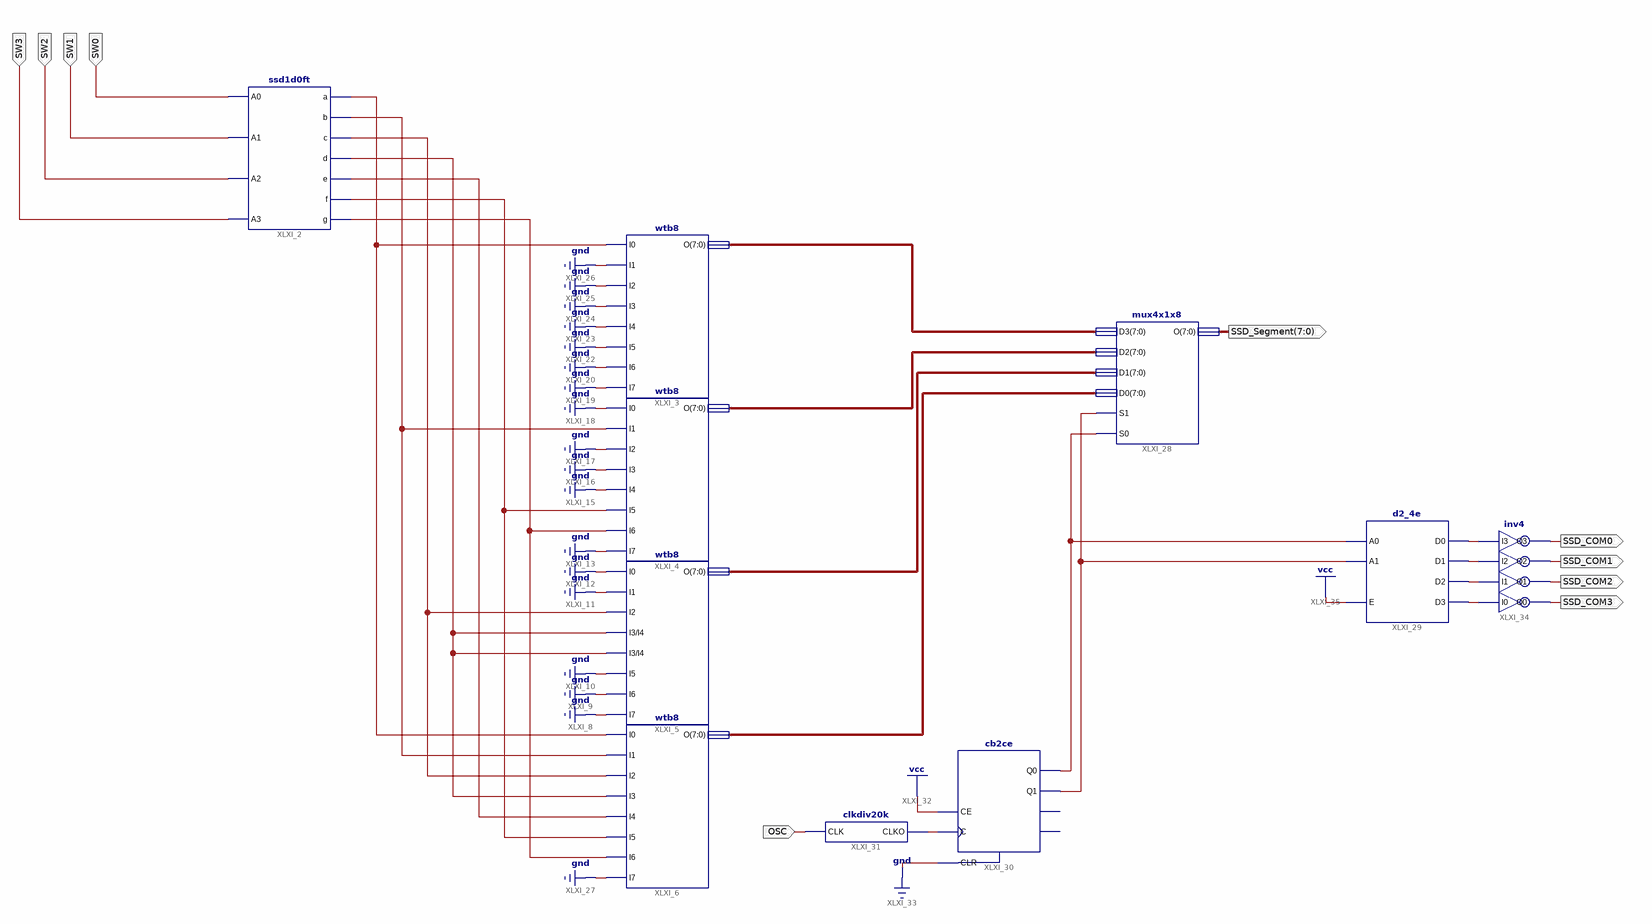
[diagram p0: schematic sheet 1]
// Xilinx ISE schematic main.sch (spartan6) as structural Verilog: 10 symbols, 10 ports
module main (
  input  SW3,
  input  SW2,
  input  SW1,
  input  SW0,
  input  OSC,
  output [7:0] SSD_Segment,
  output SSD_COM3,
  output SSD_COM2,
  output SSD_COM1,
  output SSD_COM0
);

  wire XLXN_17, XLXN_18, XLXN_19, XLXN_20, XLXN_21, XLXN_22, XLXN_23, XLXN_48, XLXN_49, XLXN_50, XLXN_54,
       XLXN_55, XLXN_56, XLXN_57;
  wire [7:0] XLXN_42, XLXN_43, XLXN_45, XLXN_46;

  ssd1d0ft XLXI_2 (
    .A0(SW0), .A1(SW1), .A2(SW2), .A3(SW3), .a(XLXN_17), .b(XLXN_18), .c(XLXN_19), .d(XLXN_20), .e(XLXN_21),
    .f(XLXN_22), .g(XLXN_23));
  wtb8 XLXI_3 (.I0(XLXN_17), .I1(1'b0), .I2(1'b0), .I3(1'b0), .I4(1'b0), .I5(1'b0), .I6(1'b0), .I7(1'b0), .O(XLXN_42));
  wtb8 XLXI_4 (
    .I0(1'b0), .I1(XLXN_18), .I2(1'b0), .I3(1'b0), .I4(1'b0), .I5(XLXN_22), .I6(XLXN_23), .I7(1'b0),
    .O(XLXN_43));
  wtb8 XLXI_5 (
    .I0(1'b0), .I1(1'b0), .I2(XLXN_19), .I3(XLXN_20), .I4(XLXN_20), .I5(1'b0), .I6(1'b0), .I7(1'b0),
    .O(XLXN_45));
  wtb8 XLXI_6 (
    .I0(XLXN_17), .I1(XLXN_18), .I2(XLXN_19), .I3(XLXN_20), .I4(XLXN_21), .I5(XLXN_22), .I6(XLXN_23),
    .I7(1'b0), .O(XLXN_46));
  mux4x1x8 XLXI_28 (
    .D3(XLXN_42), .D2(XLXN_43), .D1(XLXN_45), .D0(XLXN_46), .S1(XLXN_48), .S0(XLXN_49), .O(SSD_Segment));
  d2_4e XLXI_29 (.A0(XLXN_49), .A1(XLXN_48), .E(1'b1), .D0(XLXN_57), .D1(XLXN_56), .D2(XLXN_55), .D3(XLXN_54));
  cb2ce XLXI_30 (.C(XLXN_50), .CE(1'b1), .CLR(1'b0), .Q0(XLXN_49), .Q1(XLXN_48));  // open: CEO, TC
  clkdiv20k XLXI_31 (.CLK(OSC), .CLKO(XLXN_50));
  inv4 XLXI_34 (
    .I0(XLXN_54), .I1(XLXN_55), .I2(XLXN_56), .I3(XLXN_57), .O0(SSD_COM3), .O1(SSD_COM2), .O2(SSD_COM1),
    .O3(SSD_COM0));
endmodule
